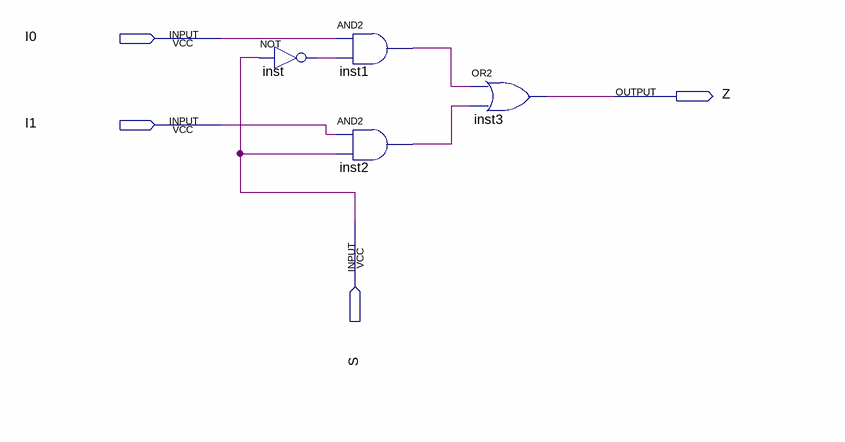
[diagram p0: schematic sheet]
// Quartus schematic Multiplexador_2_1.bdf as structural Verilog: 4 symbols, 4 pins
module Multiplexador_2_1 (
  input  I0,
  input  I1,
  input  S,
  output Z
);

  wire inst1_out, inst2_out, inst_out;

  not inst (inst_out, S);
  and inst1 (inst1_out, I0, inst_out);
  and inst2 (inst2_out, I1, S);
  or inst3 (Z, inst1_out, inst2_out);
endmodule
